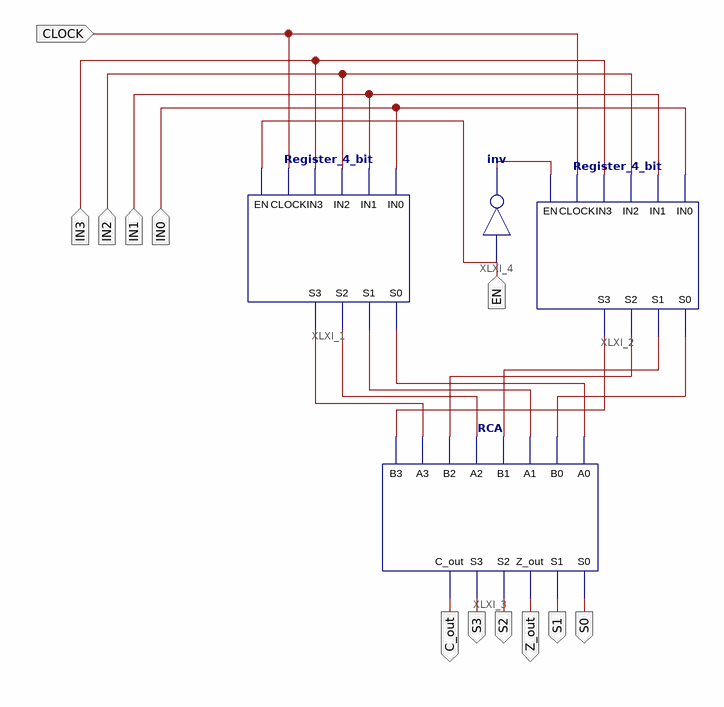
[diagram p0: schematic sheet 1]
// Xilinx ISE schematic AU.sch (spartan3e) as structural Verilog: 4 symbols, 12 ports
module AU (
  input  CLOCK,
  input  EN,
  input  IN0,
  input  IN1,
  input  IN2,
  input  IN3,
  output C_out,
  output S3,
  output S2,
  output Z_out,
  output S1,
  output S0
);

  wire XLXN_1, XLXN_2, XLXN_3, XLXN_4, XLXN_5, XLXN_6, XLXN_7, XLXN_8, XLXN_23;

  Register_4_bit XLXI_1 (
    .CLOCK(CLOCK), .EN(EN), .IN0(IN0), .IN1(IN1), .IN2(IN2), .IN3(IN3), .S0(XLXN_1), .S1(XLXN_2),
    .S2(XLXN_3), .S3(XLXN_4));
  Register_4_bit XLXI_2 (
    .CLOCK(CLOCK), .EN(XLXN_23), .IN0(IN0), .IN1(IN1), .IN2(IN2), .IN3(IN3), .S0(XLXN_8), .S1(XLXN_7),
    .S2(XLXN_6), .S3(XLXN_5));
  RCA XLXI_3 (
    .A0(XLXN_1), .A1(XLXN_2), .A2(XLXN_3), .A3(XLXN_4), .B0(XLXN_8), .B1(XLXN_7), .B2(XLXN_6), .B3(XLXN_5),
    .C_out(C_out), .S0(S0), .S1(S1), .S2(S2), .S3(S3), .Z_out(Z_out));
  not XLXI_4 (XLXN_23, EN);
endmodule
